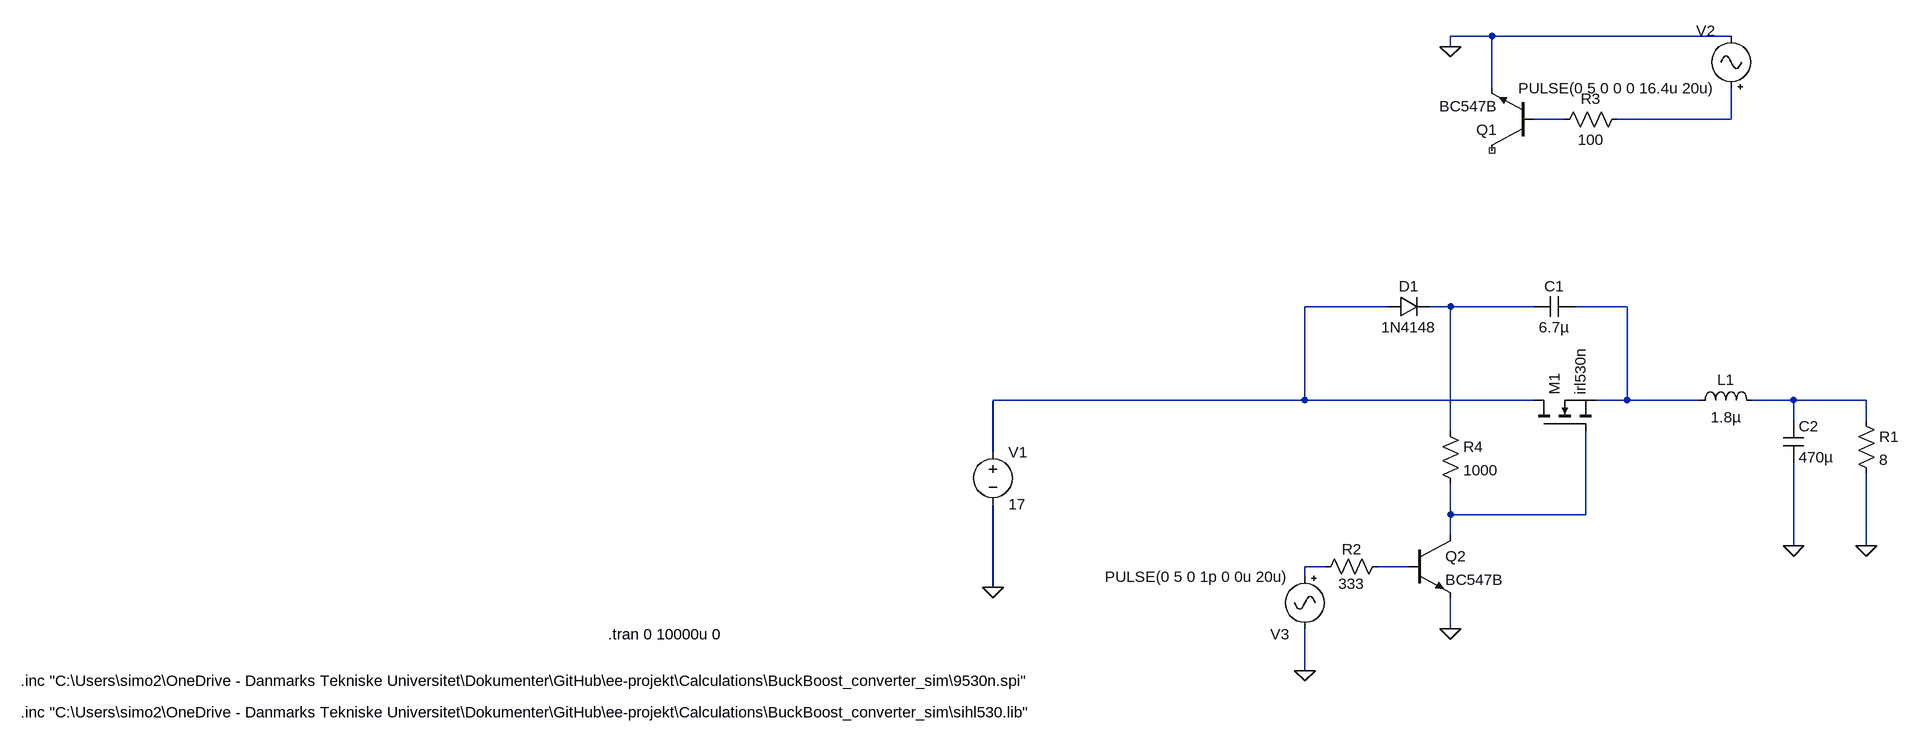
[diagram p0: schematic BuckBoost_P-Channel-v2switch.asc]
BuckBoost_P-Channel-v2switch.asc, the LTspice schematic file:
Version 4
SHEET 1 1328 832
WIRE 272 -400 208 -400
WIRE 640 -400 272 -400
WIRE 208 -384 208 -400
WIRE 272 -320 272 -400
WIRE 384 -272 336 -272
WIRE 640 -272 640 -320
WIRE 640 -272 464 -272
WIRE 112 16 -16 16
WIRE 208 16 176 16
WIRE 336 16 208 16
WIRE 480 16 400 16
WIRE -16 160 -16 16
WIRE -16 160 -496 160
WIRE 336 160 -16 160
WIRE 480 160 480 16
WIRE 480 160 432 160
WIRE 592 160 480 160
WIRE 736 160 672 160
WIRE 848 160 736 160
WIRE 736 192 736 160
WIRE 848 192 848 160
WIRE 208 208 208 16
WIRE -496 240 -496 160
WIRE 208 336 208 288
WIRE 416 336 416 208
WIRE 416 336 208 336
WIRE 208 368 208 336
WIRE 736 384 736 256
WIRE 848 384 848 272
WIRE 16 416 -16 416
WIRE 144 416 96 416
WIRE -16 432 -16 416
WIRE -496 448 -496 320
WIRE 208 512 208 464
WIRE -16 576 -16 512
FLAG -496 448 0
FLAG 208 -384 0
FLAG 848 384 0
FLAG -16 576 0
FLAG 208 512 0
FLAG 736 384 0
SYMBOL voltage -496 224 R0
WINDOW 123 0 0 Left 0
WINDOW 39 0 0 Left 0
SYMATTR InstName V1
SYMATTR Value 17
SYMBOL npn 336 -224 R180
SYMATTR InstName Q1
SYMATTR Value BC547B
SYMBOL Misc\\signal 640 -304 R180
WINDOW 0 24 104 Left 2
WINDOW 3 24 16 Left 2
WINDOW 123 0 0 Left 0
WINDOW 39 0 0 Left 0
SYMATTR InstName V2
SYMATTR Value PULSE(0 5 0 0 0 16.4u 20u)
SYMBOL res 480 -288 R90
WINDOW 0 0 56 VBottom 2
WINDOW 3 32 56 VTop 2
SYMATTR InstName R3
SYMATTR Value 100
SYMBOL res 832 176 R0
SYMATTR InstName R1
SYMATTR Value 8
SYMBOL res 112 400 R90
WINDOW 0 5 56 VBottom 2
WINDOW 3 27 56 VTop 2
SYMATTR InstName R2
SYMATTR Value 333
SYMBOL Misc\\signal -16 416 M0
WINDOW 0 24 104 Left 2
WINDOW 3 24 16 Left 2
WINDOW 123 0 0 Left 0
WINDOW 39 0 0 Left 0
SYMATTR InstName V3
SYMATTR Value PULSE(0 5 0 1p 0 0u 20u)
SYMBOL nmos 336 208 R270
SYMATTR InstName M1
SYMATTR Value irl530n
SYMATTR Prefix X
SYMBOL cap 400 0 R90
WINDOW 0 0 32 VBottom 2
WINDOW 3 32 32 VTop 2
SYMATTR InstName C1
SYMATTR Value 6.7µ
SYMBOL diode 112 32 R270
WINDOW 0 32 32 VTop 2
WINDOW 3 0 32 VBottom 2
SYMATTR InstName D1
SYMATTR Value 1N4148
SYMBOL npn 144 368 R0
SYMATTR InstName Q2
SYMATTR Value BC547B
SYMBOL res 192 192 R0
SYMATTR InstName R4
SYMATTR Value 1000
SYMBOL ind 576 176 R270
WINDOW 0 32 56 VTop 2
WINDOW 3 5 56 VBottom 2
SYMATTR InstName L1
SYMATTR Value 1.8µ
SYMBOL cap 720 192 R0
SYMATTR InstName C2
SYMATTR Value 470µ
TEXT -1992 592 Left 2 !.inc "C:\\Users\\simo2\\OneDrive - Danmarks Tekniske Universitet\\Dokumenter\\GitHub\\ee-projekt\\Calculations\\BuckBoost_converter_sim\\9530n.spi"
TEXT -1088 520 Left 2 !.tran 0 10000u 0
TEXT -1992 640 Left 2 !.inc "C:\\Users\\simo2\\OneDrive - Danmarks Tekniske Universitet\\Dokumenter\\GitHub\\ee-projekt\\Calculations\\BuckBoost_converter_sim\\sihl530.lib"

The netlist it stands for:
* BuckBoost_P-Channel-v2switch.asc
V1 N003 0 17
Q1 NC_01 N001 0 0 BC547B
V2 N002 0 PULSE(0 5 0 0 0 16.4u 20u)
R3 N002 N001 100
R1 N006 0 8
R2 N009 N008 333
V3 N008 0 PULSE(0 5 0 1p 0 0u 20u)
XM1 N003 N007 N005 irl530n  ; pins D G S
C1 N005 N004 6.7µ
D1 N003 N004 1N4148
Q2 N007 N009 0 0 BC547B
R4 N004 N007 1000
L1 N005 N006 1.8µ
C2 N006 0 470µ
.model D D
.lib standard.dio
.model NPN NPN
.model PNP PNP
.lib standard.bjt
.inc "C:\Users\simo2\OneDrive - Danmarks Tekniske Universitet\Dokumenter\GitHub\ee-projekt\Calculations\BuckBoost_converter_sim\9530n.spi"
.tran 0 10000u 0
.inc "C:\Users\simo2\OneDrive - Danmarks Tekniske Universitet\Dokumenter\GitHub\ee-projekt\Calculations\BuckBoost_converter_sim\sihl530.lib"
.backanno
.end